# EAGLE schematic GasSensorModule_v2.0 (EAGLE 7.2.0)
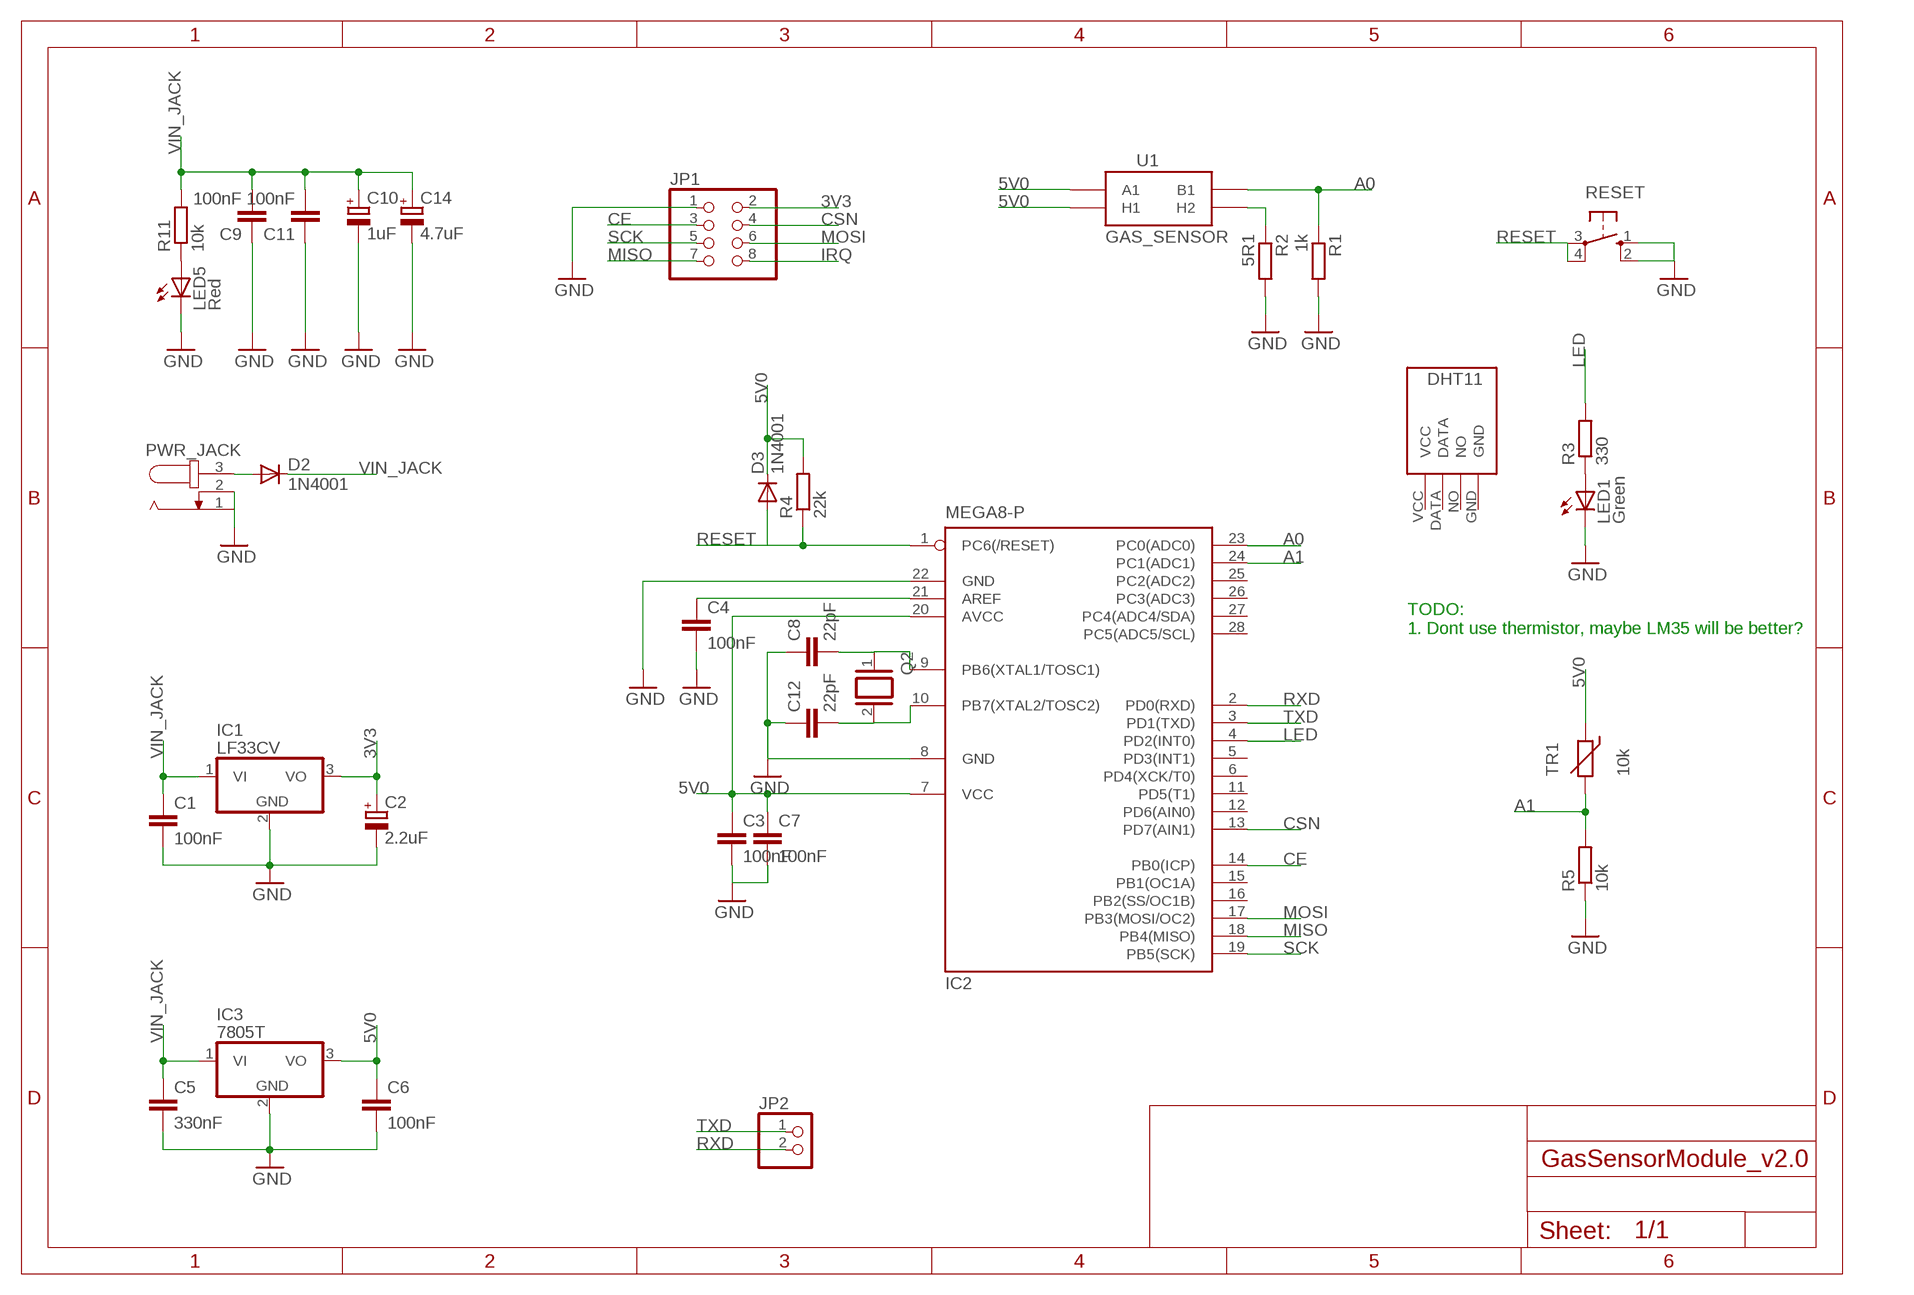
[diagram p0: schematic, sheet 1]

## Parts
C1  100nF  C-EU025-025X050  [C025-025X050]
C2  2.2uF  CPOL-EUE2.5-5  [E2,5-5]
C3  100nF  C-EU025-025X050  [C025-025X050]
C4  100nF  C-EU025-025X050  [C025-025X050]
C5  330nF  C-EU025-025X050  [C025-025X050]
C6  100nF  C-EU025-025X050  [C025-025X050]
C7  100nF  C-EU025-025X050  [C025-025X050]
C8  22pF  C-EU025-025X050  [C025-025X050]
C9  100nF  C-EU025-025X050  [C025-025X050]
C10  1uF  CPOL-EUE2.5-5  [E2,5-5]
C11  100nF  C-EU025-025X050  [C025-025X050]
C12  22pF  C-EU025-025X050  [C025-025X050]
C14  4.7uF  CPOL-EUE2.5-5  [E2,5-5]
D2  1N4001  1N4004  [DO41-10]
D3  1N4001  1N4004  [DO41-10]
IC1  LF33CV  7805T  [TO220H]
IC2  MEGA8-P  [DIL28-3]
IC3  7805T  [TO220H]
JP1  PINHD-2X4  [2X04]
JP2  PINHD-1X2/90  [1X02/90]
LED1  Green  LED3MM  [LED3MM]
LED5  Red  LED3MM  [LED3MM]
PWR_JACK  JACK-PLUG0  [SPC4077]
Q2  XTAL/S  [QS]
R1  1k  R-EU_0207/10  [0207/10]
R2  5R1  R-EU_0207/10  [0207/10]
R3  330  R-EU_0207/10  [0207/10]
R4  22k  R-EU_0207/10  [0207/10]
R5  10k  R-EU_0207/10  [0207/10]
R11  10k  R-EU_0207/10  [0207/10]
RESET  10-XX  [B3F-10XX]
TR1  10k  THERMISTOR_R-2,5  [RS-2,5]
U1  GAS_SENSOR  [MQ-3]
U$1  DHT11-PION.  [DHT11-PION.]

## Nets
3V3: C2.+ IC1.3(VO) JP1.2
5V0: C3.1 C6.1 C7.1 D3.C IC2.7(VCC) IC2.20(AVCC) IC3.3(VO) R4.2 TR1.1 U1.A1 U1.HA(H1)
A0: IC2.23(PC0(ADC0)) R1.1 U1.B1
A1: IC2.24(PC1(ADC1)) R5.2 TR1.2
CE: IC2.14(PB0(ICP)) JP1.3
CSN: IC2.13(PD7(AIN1)) JP1.4
GND: C1.2 C2.- C3.2 C4.2 C5.2 C6.2 C7.2 C8.1 C9.1 C10.- C11.1 C12.1 C14.- IC1.2(GND) IC2.8(GND) IC2.22(GND) IC3.2(GND) JP1.1 LED1.K(C) LED5.K(C) PWR_JACK.1 PWR_JACK.2 R1.2 R2.2 R5.1 RESET.1(S) RESET.2(S1)
IRQ: JP1.8
LED: IC2.4(PD2(INT0)) R3.2
MISO: IC2.18(PB4(MISO)) JP1.7
MOSI: IC2.17(PB3(MOSI/OC2)) JP1.6
N$1: C4.1 IC2.21(AREF)
N$3: R2.1 U1.HB(H2)
N$4: D2.A PWR_JACK.3
N$5: LED1.A R3.1
N$10: LED5.A R11.1
N$29: C8.2 IC2.9(PB6(XTAL1/TOSC1)) Q2.1
N$35: C12.2 IC2.10(PB7(XTAL2/TOSC2)) Q2.2
RESET: D3.A IC2.1(PC6(/RESET)) R4.1 RESET.3(P) RESET.4(P1)
RXD: IC2.2(PD0(RXD)) JP2.2
SCK: IC2.19(PB5(SCK)) JP1.5
TXD: IC2.3(PD1(TXD)) JP2.1
VIN_JACK: C1.1 C5.1 C9.2 C10.+ C11.2 C14.+ D2.C IC1.1(VI) IC3.1(VI) R11.2
Unconnected: IC2.5(PD3(INT1)) IC2.6(PD4(XCK/T0)) IC2.11(PD5(T1)) IC2.12(PD6(AIN0)) IC2.15(PB1(OC1A)) IC2.16(PB2(SS/OC1B)) IC2.25(PC2(ADC2)) IC2.26(PC3(ADC3)) IC2.27(PC4(ADC4/SDA)) IC2.28(PC5(ADC5/SCL)) U$1.DATA U$1.GND U$1.NO U$1.VCC

## Notes on the sheet
- TODO:
  1. Dont use thermistor, maybe LM35 will be better?

## Library data of the parts
C1 C3-C9 C11 C12 = rcl:C-EU: CAPACITOR, European symbol
C2 C10 C14 = rcl:CPOL-EU: POLARIZED CAPACITOR, European symbol
D2 D3 = diode:1N4004: DIODE general purpose rectifier, 1 A
IC1 IC3 = linear:78*: Positive VOLTAGE REGULATOR Source: http://cache.national.com/ds/LM/LM78L05.pdf http://www.fairchildsemi.com/ds/LM/LM7805.pdf
IC2 = atmel:MEGA8-P: MICROCONTROLLER 8 Kbytes FLASH, 1 kbytes SRAM, 512 bytes EEPROM, USART, 4-channel 10 bit ADC, 2-channel 8 bit ADC Pin compatible with Atmega48, ATMega88, ATMega168 Source: avr.lbr; OC_FARNELL: unknown; OC_NEWARK: unknown
JP1 = pinhead:PINHD-2X4: PIN HEADER
JP2 = pinhead:PINHD-1X2: PIN HEADER
LED1 LED5 = led:LED: LED OSRAM: - CHIPLED LG R971, LG N971, LY N971, LG Q971, LY Q971, LO R971, LY R971 LH N974, LH R974 LS Q976, LO Q976, LY Q976 LO Q996 - Hyper CHIPLED LW Q18S LB Q993, LB Q99A, LB R99A - SideLED LS A670, LO A670, LY A670, LG A670, LP A670 LB A673, LV A673, LT A673, LW A673 LH A674 LY A675 LS A676, LA A676, LO A676, LY A676, LW A676 LS A679, LY A679, LG A679 - Hyper Micro SIDELED® LS Y876, LA Y876, LO Y876, LY Y876 LT Y87S - SmartLED LW L88C, LW L88S LB L89C, LB L89S, LG L890 LS L89K, LO L89K, LY L89K LS L896, LA L896, LO L896, LY L896 - TOPLED LS T670, LO T670, LY T670, LG T670, LP T670 LSG T670, LSP T670, LSY T670, LOP T670, LYG T670 LG T671, LOG T671, LSG T671 LB T673, LV T673, LT T673, LW T673 LH T674 LS T676, LA T676, LO T676, LY T676, LB T676, LH T676, LSB T676, LW T676 LB T67C, LV T67C, LT T67C, LS T67K, LO T67K, LY T67K, LW E67C LS E67B, LA E67B, LO E67B, LY E67B, LB E67C, LV E67C, LT E67C LW T67C LS T679, LY T679, LG T679 LS T770, LO T770, LY T770, LG T770, LP T770 LB T773, LV T773, LT T773, LW T773 LH T774 LS E675, LA E675, LY E675, LS T675 LS T776, LA T776, LO T776, LY T776, LB T776 LHGB T686 LT T68C, LB T68C - Hyper Mini TOPLED® LB M676 - Mini TOPLED Santana® LG M470 LS M47K, LO M47K, LY M47K Source: http://www.osram.convergy.de LUXEON: - LUMILED® LXK2-PW12-R00, LXK2-PW12-S00, LXK2-PW14-U00, LXK2-PW14-V00 LXK2-PM12-R00, LXK2-PM12-S00, LXK2-PM14-U00 LXK2-PE12-Q00, LXK2-PE12-R00, LXK2-PE12-S00, LXK2-PE14-T00, LXK2-PE14-U00 LXK2-PB12-K00, LXK2-PB12-L00, LXK2-PB12-M00, LXK2-PB14-N00, LXK2-PB14-P00, LXK2-PB14-Q00 LXK2-PR12-L00, LXK2-PR12-M00, LXK2-PR14-Q00, LXK2-PR14-R00 LXK2-PD12-Q00, LXK2-PD12-R00, LXK2-PD12-S00 LXK2-PH12-R00, LXK2-PH12-S00 LXK2-PL12-P00, LXK2-PL12-Q00, LXK2-PL12-R00 Source: www.luxeon.com KINGBRIGHT: KA-3528ASYC Source: www.kingbright.com
PWR_JACK = con-jack:JACK-PLUG: DC POWER JACK Power Jack, DC, Right Angle, Through Hole, Rated 5A at 16VDC, PC Terminals Distributor: Farnell (www.Farnell.de) Drawing: 84N1161.pdf / 84N1162.pdf Manufacturer: SPC Technology (www.spctechnology.com) Type: SPC4077 / SPC 4078; OC_FARNELL: unknown; OC_NEWARK: unknown
Q2 = special:XTAL/S: CRYSTAL
R1-R5 R11 = rcl:R-EU_: RESISTOR, European symbol
RESET = switch-omron:10-XX: OMRON SWITCH; MPN: B3F-1000; OC_FARNELL: 176432; OC_NEWARK: 36M3542
TR1 = discrete:THERMISTOR_: Thermo Resistor
U1 = SparkFun-Sensors:GAS_SENSOR: MQ-3 alcohol gas sensor . FP not tested. SEN-08880.
U$1 = DHT11:DHT11-PION.: DHT11 Czujnik temperatury i wilgotności (widok pionowy)